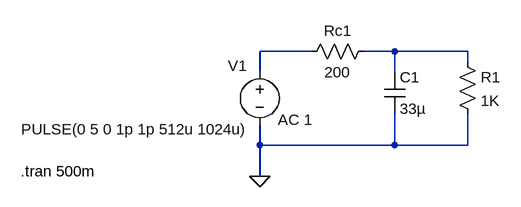
[diagram p0: schematic PWM RC filter.asc]
PWM RC filter.asc, the LTspice schematic file:
Version 4
SHEET 1 880 680
WIRE 288 112 208 112
WIRE 416 112 368 112
WIRE 528 112 416 112
WIRE 528 128 528 112
WIRE 208 144 208 112
WIRE 416 144 416 112
WIRE 208 256 208 224
WIRE 416 256 416 208
WIRE 416 256 208 256
WIRE 528 256 528 208
WIRE 528 256 416 256
WIRE 208 304 208 256
FLAG 208 304 0
SYMBOL voltage 208 128 R0
WINDOW 123 28 89 Left 2
WINDOW 39 0 0 Left 2
WINDOW 3 -367 104 Left 2
WINDOW 0 -49 6 Left 2
SYMATTR Value2 AC 1
SYMATTR Value PULSE(0 5 0 1p 1p 512u 1024u)
SYMATTR InstName V1
SYMBOL res 384 96 R90
WINDOW 0 0 56 VBottom 2
WINDOW 3 32 56 VTop 2
SYMATTR InstName Rc1
SYMATTR Value 200
SYMBOL cap 400 144 R0
SYMATTR InstName C1
SYMATTR Value 33µ
SYMBOL res 512 112 R0
SYMATTR InstName R1
SYMATTR Value 1K
TEXT -160 296 Left 2 !.tran 500m

The netlist it stands for:
* PWM RC filter.asc
V1 N001 0 PULSE(0 5 0 1p 1p 512u 1024u) AC 1
Rc1 N002 N001 200
C1 N002 0 33µ
R1 N002 0 1K
.tran 500m
.backanno
.end